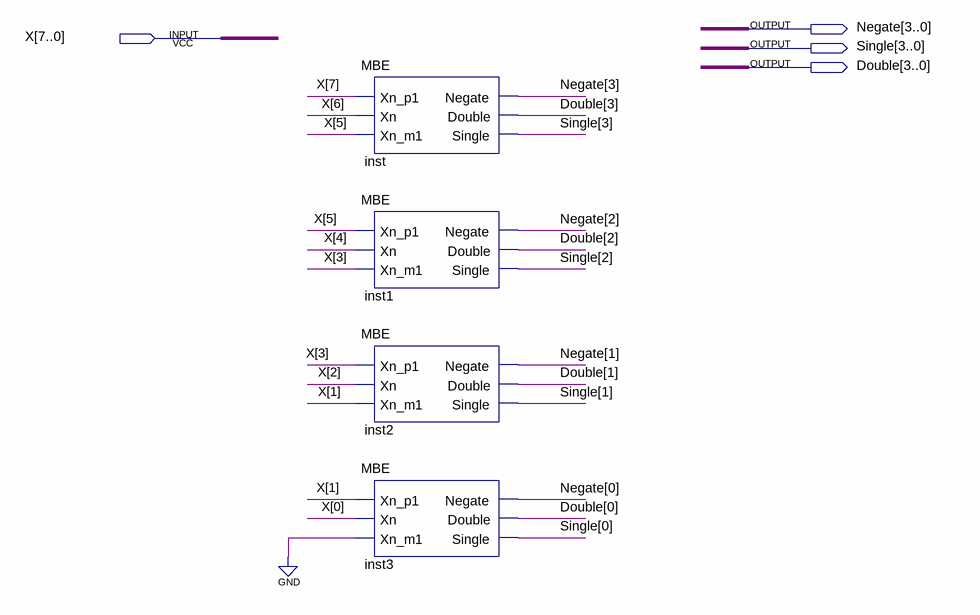
[diagram p0: schematic sheet]
// Quartus schematic MBE_wordslice.bdf as structural Verilog: 4 symbols, 4 pins
module MBE_wordslice (
  input  [7:0] X,
  output [3:0] Negate,
  output [3:0] Single,
  output [3:0] Double
);

  MBE inst (.Xn_p1(X[7]), .Xn(X[6]), .Xn_m1(X[5]), .Negate(Negate[3]), .Double(Double[3]), .Single(Single[3]));
  MBE inst1 (.Xn_p1(X[5]), .Xn(X[4]), .Xn_m1(X[3]), .Negate(Negate[2]), .Double(Double[2]), .Single(Single[2]));
  MBE inst2 (.Xn_p1(X[3]), .Xn(X[2]), .Xn_m1(X[1]), .Negate(Negate[1]), .Double(Double[1]), .Single(Single[1]));
  MBE inst3 (.Xn_p1(X[1]), .Xn(X[0]), .Xn_m1(1'b0), .Negate(Negate[0]), .Double(Double[0]), .Single(Single[0]));
endmodule
